# Altium schematic sheet MP3.SchDoc
size 381 x 241 mm
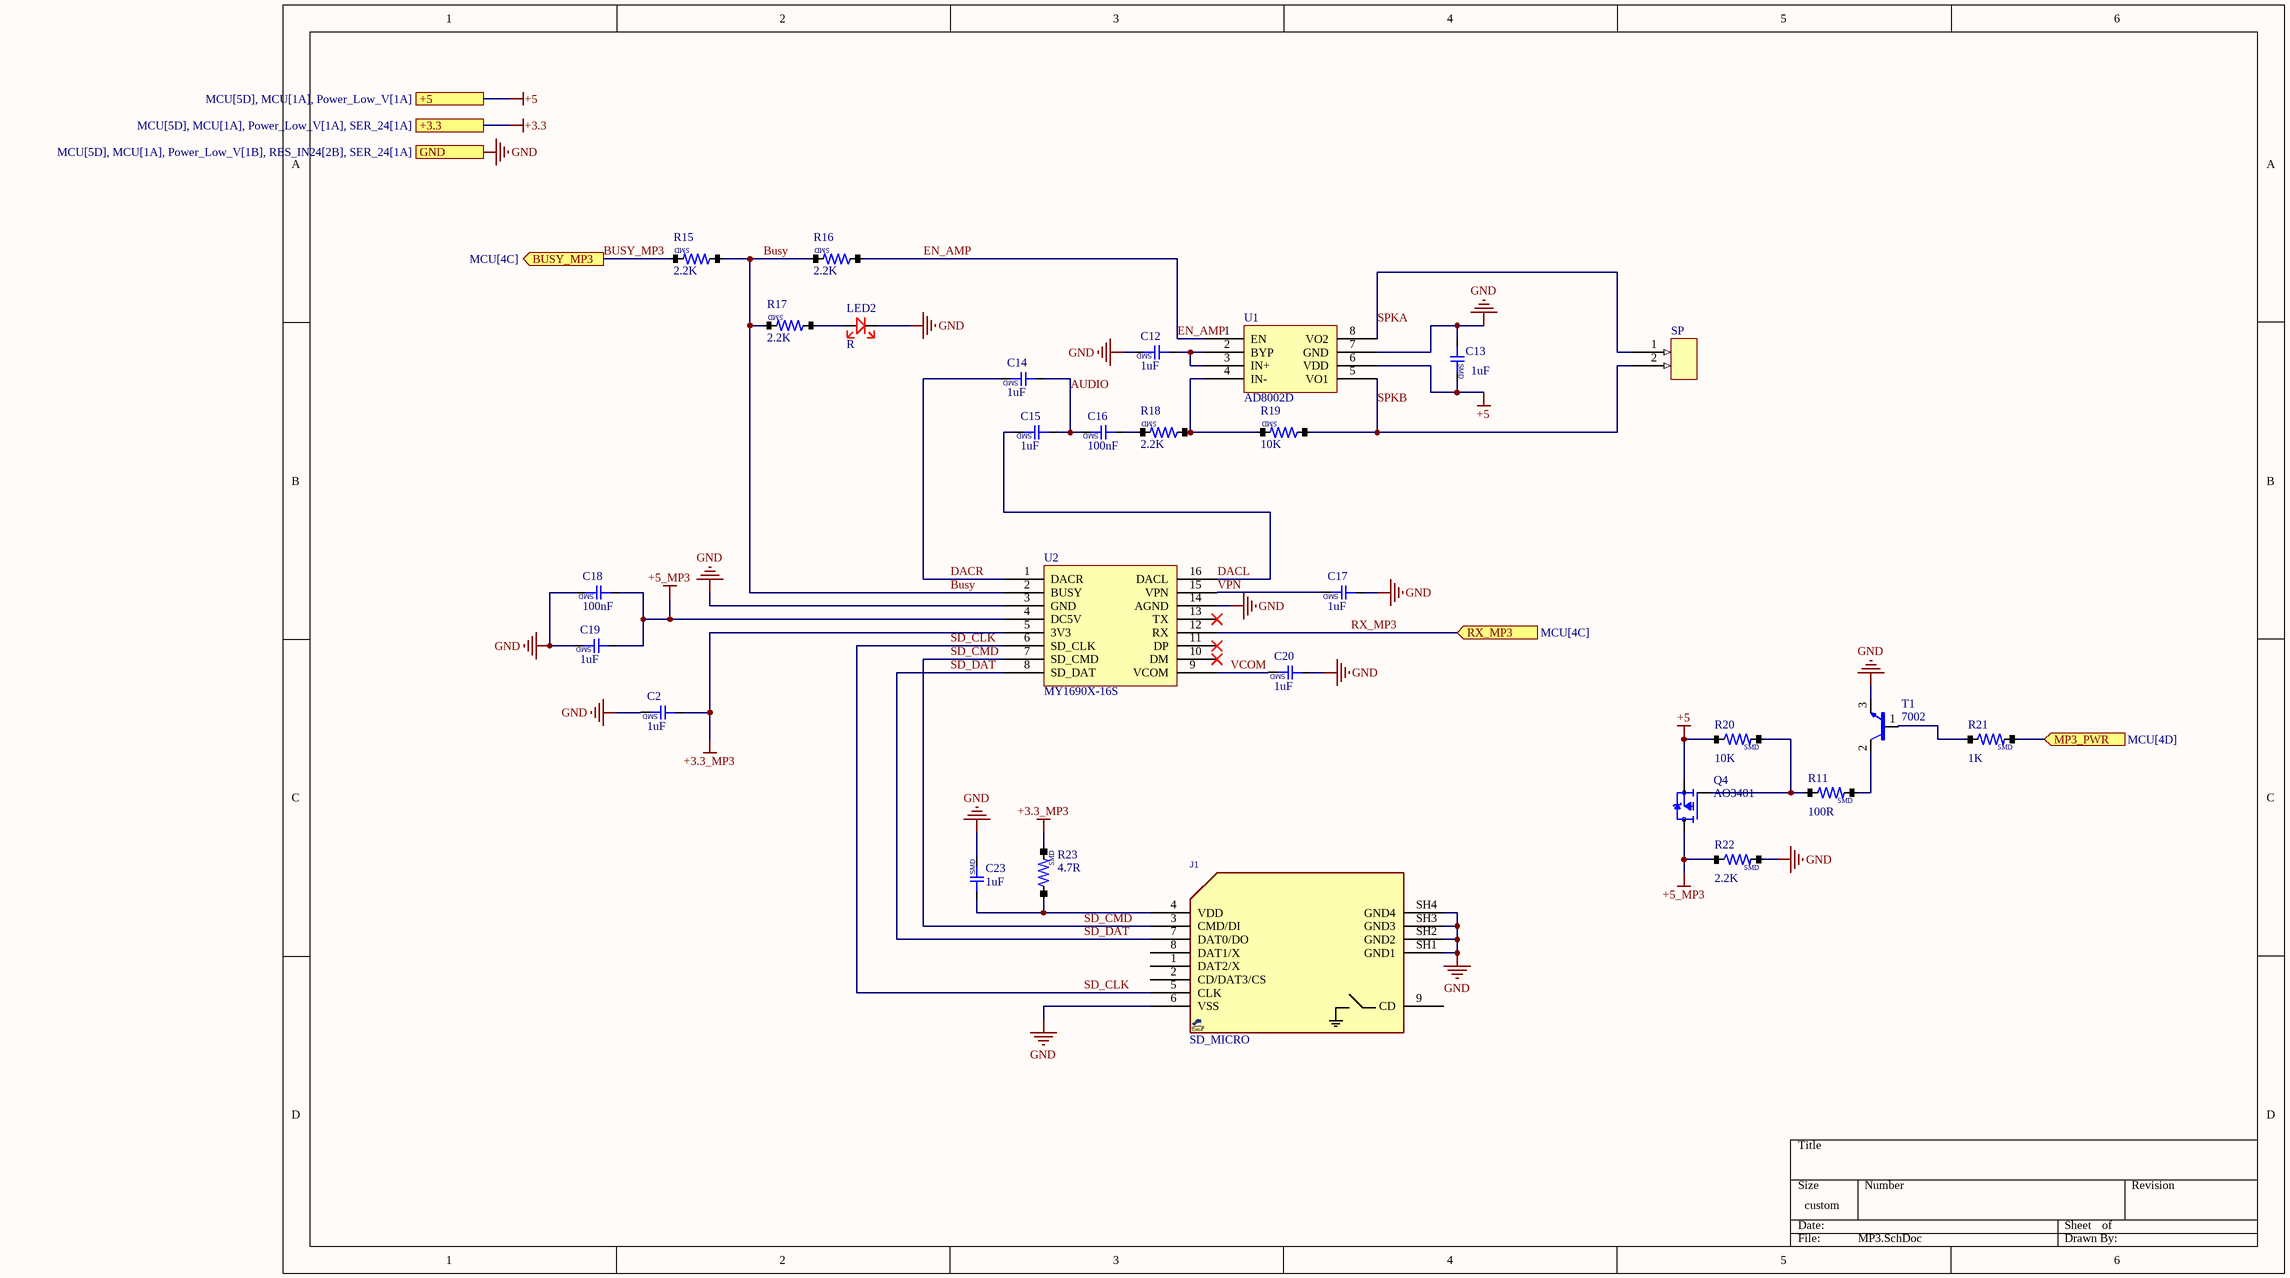
[diagram p0: MP3.SchDoc]

## Parts
C2  1uF  [CAP-0805]
C12  1uF  [CAP-0805]
C13  1uF  [CAP-0805]
C14  1uF  [CAP-0603]
C15  1uF  [CAP-0603]
C16  100nF  [CAP-0603]
C17  1uF  [CAP-0805]
C18  100nF  [CAP-0603]
C19  1uF  [CAP-0805]
C20  1uF  [CAP-0805]
C23  1uF  [CAP-0805]
J1  SD_MICRO  [MEMORY_RAVIS]
LED2  R  [LED/0805]
Q4  AO3401  [AO3401A]
R11  100R  [RES/0603]
R15  2.2K  [RES/0603]
R16  2.2K  [RES/0603]
R17  2.2K  [RES/0603]
R18  2.2K  [RES/0603]
R19  10K  [RES/0603]
R20  10K  [RES/0603]
R21  1K  [RES/0603]
R22  2.2K  [RES/0603]
R23  4.7R  [RES/0805]
SP  CONECTOR/FONIX/2PIN  [CONECTOR/FONIX/2PIN]  (value not drawn)
T1  7002  [SOT23]
U1  AD8002D  [SOP-8]
U2  MY1690X-16S  [TL494_SMD]

## Ports
+3.3 (see MCU[5D], MCU[1A], Power_Low_V[1A], SER_24[1A]), +5 (see MCU[5D], MCU[1A], Power_Low_V[1A]), BUSY_MP3 (out, see MCU[4C]), GND (see MCU[5D], MCU[1A], Power_Low_V[1B], RES_IN24[2B], SER_24[1A]), MP3_PWR (in, see MCU[4D]), RX_MP3 (in, see MCU[4C])

## Nets
+3.3: port +3.3
+3.3_MP3: C2.1 R23.2 U2.5(3V3)
+5: C13.2 Q4.S R20.1 U1.6(VDD) ; port +5
+5_MP3: C18.1 C19.1 Q4.D R22.1 U2.4(DC5V)
GND: C2.2 C12.2 C13.1 C17.1 C18.2 C19.2 C20.1 C23.2 J1.6(VSS) J1.SH1(GND1) J1.SH2(GND2) J1.SH3(GND3) J1.SH4(GND4) LED2.K R22.2 T1.3(E) U1.7(GND) U2.3(GND) U2.14(AGND) ; port GND
AUDIO: C14.1 C15.1 C16.2
Busy: R15.1 R16.2 R17.2 U2.2(BUSY)
BUSY_MP3: R15.2 ; port BUSY_MP3
DACL: C15.2 U2.16(DACL)
DACR: C14.2 U2.1(DACR)
EN_AMP: R16.1 U1.1(EN)
MP3_PWR: R21.2 ; port MP3_PWR
RX_MP3: U2.12(RX) ; port RX_MP3
SD_CLK: J1.5(CLK) U2.6(SD_CLK)
SD_CMD: J1.3(CMD/DI) U2.7(SD_CMD)
SD_DAT: J1.7(DAT0/DO) U2.8(SD_DAT)
SPKA: SP.1 U1.8(VO2)
SPKB: R19.1 SP.2 U1.5(VO1)
VCOM: C20.2 U2.9(VCOM)
VPN: C17.2 U2.15(VPN)
NetC12_1: C12.1 U1.2(BYP) U1.3(IN+)
NetC16_1: C16.1 R18.2
NetC23_1: C23.1 J1.4(VDD) R23.1
NetLED2_A: LED2.A R17.1
NetQ4_G: Q4.G R11.1 R20.2
NetR11_2: R11.2 T1.2(C)
NetR18_1: R18.1 R19.2 U1.4(IN-)
NetR21_1: R21.1 T1.1(B)

Not connected (* = marked no-connect by the designer): J1 1(DAT2/X) 2(CD/DAT3/CS) 8(DAT1/X) 9(CD); U2 10(DM)* 11(DP)* 13(TX)*

## Notes on the sheet
- (in symbol cap_smd) SMD
- (in symbol RES/SMD) SMD

## Library data of the parts
C2 C12-C20 C23 = cap_smd
J1 = SOCKET_SDMICRO_AT: SD MICRO exist in Iran, Attend 112J-TDAR-R01; PARAM: push-push; MANF: Attend; MANF_P#: 112J-TDAR-R01; VALUE: SD_MICRO
LED2 = LED-1COLER
Q4 = MOSFET_P_CH
R11 R15-R23 = RES/SMD
T1 = NPN
U2 = MY1690X-16S: IC, MP3 Player